# Altium schematic sheet LED Driver.SchDoc
size A
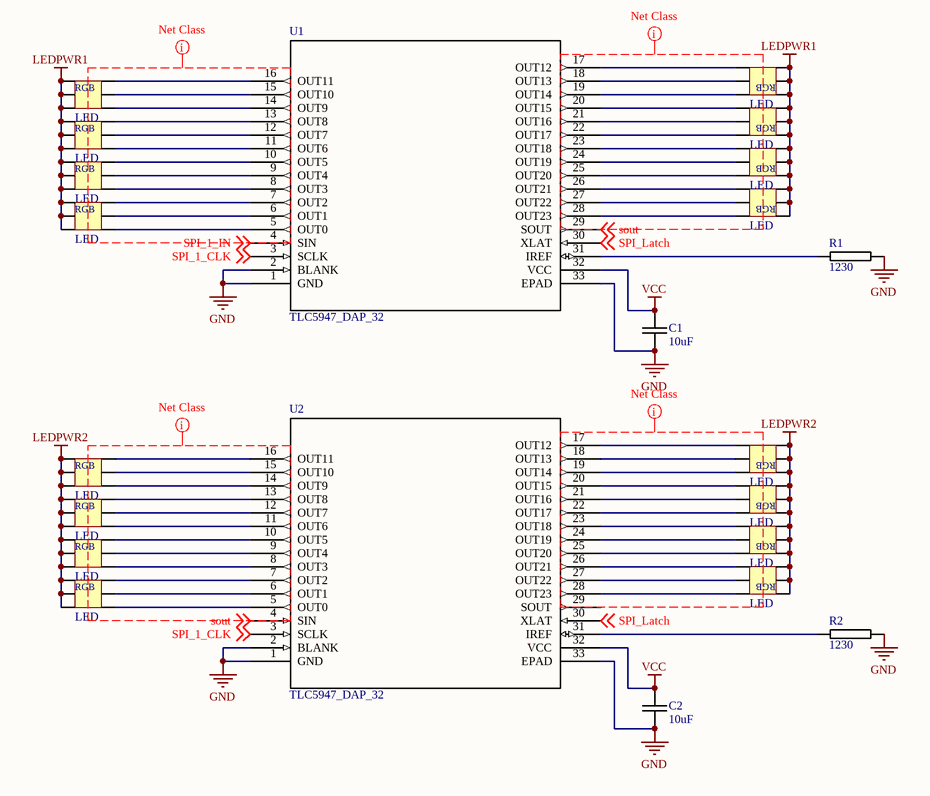
[diagram p0: LED Driver.SchDoc]

## Parts
C1  10uF  [0603C-GENERIC]
C2  10uF  [0603C-GENERIC]
D1  LED  [LED-TRICOLOR-5050]
D2  LED  [LED-TRICOLOR-5050]
D3  LED  [LED-TRICOLOR-5050]
D4  LED  [LED-TRICOLOR-5050]
D5  LED  [LED-TRICOLOR-5050]
D6  LED  [LED-TRICOLOR-5050]
D7  LED  [LED-TRICOLOR-5050]
D8  LED  [LED-TRICOLOR-5050]
D9  LED  [LED-TRICOLOR-5050]
D10  LED  [LED-TRICOLOR-5050]
D11  LED  [LED-TRICOLOR-5050]
D12  LED  [LED-TRICOLOR-5050]
D13  LED  [LED-TRICOLOR-5050]
D14  LED  [LED-TRICOLOR-5050]
D15  LED  [LED-TRICOLOR-5050]
D16  LED  [LED-TRICOLOR-5050]
R1  1230  [0603R-TBD]
R2  1230  [0603R-TBD]
U1  TLC5947_DAP_32  [DAP32_4P36X4P11]
U2  TLC5947_DAP_32  [DAP32_4P36X4P11]

## Nets
GND: C1.2 C2.2 R1.2 R2.2 U1.1(GND) U1.2(BLANK) U1.33(EPAD) U2.1(GND) U2.2(BLANK) U2.33(EPAD)
LEDPWR1: D1.1(CB) D1.2(CR) D1.3(CG) D2.1(CB) D2.2(CR) D2.3(CG) D3.1(CB) D3.2(CR) D3.3(CG) D4.1(CB) D4.2(CR) D4.3(CG) D5.1(CB) D5.2(CR) D5.3(CG) D6.1(CB) D6.2(CR) D6.3(CG) D7.1(CB) D7.2(CR) D7.3(CG) D8.1(CB) D8.2(CR) D8.3(CG)
LEDPWR2: D9.1(CB) D9.2(CR) D9.3(CG) D10.1(CB) D10.2(CR) D10.3(CG) D11.1(CB) D11.2(CR) D11.3(CG) D12.1(CB) D12.2(CR) D12.3(CG) D13.1(CB) D13.2(CR) D13.3(CG) D14.1(CB) D14.2(CR) D14.3(CG) D15.1(CB) D15.2(CR) D15.3(CG) D16.1(CB) D16.2(CR) D16.3(CG)
VCC: C1.1 C2.1 U1.32(VCC) U2.32(VCC)
sout: U1.29(SOUT) U2.4(SIN) ; off-sheet sout
SPI_1_CLK: U1.3(SCLK) U2.3(SCLK) ; off-sheet SPI_1_CLK
SPI_1_IN: U1.4(SIN) ; off-sheet SPI_1_IN
SPI_Latch: U1.30(XLAT) U2.30(XLAT) ; off-sheet SPI_Latch
NetD1_4: D1.4(AB) U1.19(OUT14)
NetD1_5: D1.5(AR) U1.18(OUT13)
NetD1_6: D1.6(AG) U1.17(OUT12)
NetD2_4: D2.4(AB) U1.16(OUT11)
NetD2_5: D2.5(AR) U1.15(OUT10)
NetD2_6: D2.6(AG) U1.14(OUT9)
NetD3_4: D3.4(AB) U1.22(OUT17)
NetD3_5: D3.5(AR) U1.21(OUT16)
NetD3_6: D3.6(AG) U1.20(OUT15)
NetD4_4: D4.4(AB) U1.13(OUT8)
NetD4_5: D4.5(AR) U1.12(OUT7)
NetD4_6: D4.6(AG) U1.11(OUT6)
NetD5_4: D5.4(AB) U1.25(OUT20)
NetD5_5: D5.5(AR) U1.24(OUT19)
NetD5_6: D5.6(AG) U1.23(OUT18)
NetD6_4: D6.4(AB) U1.10(OUT5)
NetD6_5: D6.5(AR) U1.9(OUT4)
NetD6_6: D6.6(AG) U1.8(OUT3)
NetD7_4: D7.4(AB) U1.28(OUT23)
NetD7_5: D7.5(AR) U1.27(OUT22)
NetD7_6: D7.6(AG) U1.26(OUT21)
NetD8_4: D8.4(AB) U1.7(OUT2)
NetD8_5: D8.5(AR) U1.6(OUT1)
NetD8_6: D8.6(AG) U1.5(OUT0)
NetD9_4: D9.4(AB) U2.19(OUT14)
NetD9_5: D9.5(AR) U2.18(OUT13)
NetD9_6: D9.6(AG) U2.17(OUT12)
NetD10_4: D10.4(AB) U2.16(OUT11)
NetD10_5: D10.5(AR) U2.15(OUT10)
NetD10_6: D10.6(AG) U2.14(OUT9)
NetD11_4: D11.4(AB) U2.22(OUT17)
NetD11_5: D11.5(AR) U2.21(OUT16)
NetD11_6: D11.6(AG) U2.20(OUT15)
NetD12_4: D12.4(AB) U2.13(OUT8)
NetD12_5: D12.5(AR) U2.12(OUT7)
NetD12_6: D12.6(AG) U2.11(OUT6)
NetD13_4: D13.4(AB) U2.25(OUT20)
NetD13_5: D13.5(AR) U2.24(OUT19)
NetD13_6: D13.6(AG) U2.23(OUT18)
NetD14_4: D14.4(AB) U2.10(OUT5)
NetD14_5: D14.5(AR) U2.9(OUT4)
NetD14_6: D14.6(AG) U2.8(OUT3)
NetD15_4: D15.4(AB) U2.28(OUT23)
NetD15_5: D15.5(AR) U2.27(OUT22)
NetD15_6: D15.6(AG) U2.26(OUT21)
NetD16_4: D16.4(AB) U2.7(OUT2)
NetD16_5: D16.5(AR) U2.6(OUT1)
NetD16_6: D16.6(AG) U2.5(OUT0)
NetR1_1: R1.1 U1.31(IREF)
NetR2_1: R2.1 U2.31(IREF)

Not connected (* = marked no-connect by the designer): U2 29(SOUT)

## Layout directives
net class LEDGnd: (no net found under the mark), sout, SPI_1_IN

## Notes on the sheet
- (in symbol RGB LED) RGB

## Library data of the parts
C1 C2 = 0603C-10UF-10V-X5R-TDK: CAPACITOR 0603 CERAMIC; Manufacturer Part Number: C1608X5R0J106M; Manufacturer: TDK Corporation; Reel: C31; Supplier 1: Digi-Key; Supplier Part Number 1: 445-4112-2-ND
D1-D16 = RGB LED
R1 R2 = 0603R-TBD: RESISTOR 0603 VALUE TO BE DETERMINED
U1 U2 = TLC5947_DAP_32: Imported; Vendor: Texas Instruments; PACKAGE_DESIGNATOR: DAP; PIN_COUNT: 32; FAMILY_NAME: LED DRIVER; INDUSTRY_STD_PKG_TYPE: HTSSOP; Manufacturer_Part_Number: tlc5947_dap_32; GENERIC_PART_NUMBER: TLC5947; Datasheet URL: http://www.ti.com/lit/gpn/TLC5947; Manufacturer: Texas Instruments; RefDes: RefDes; Type: DEV; Value: Value